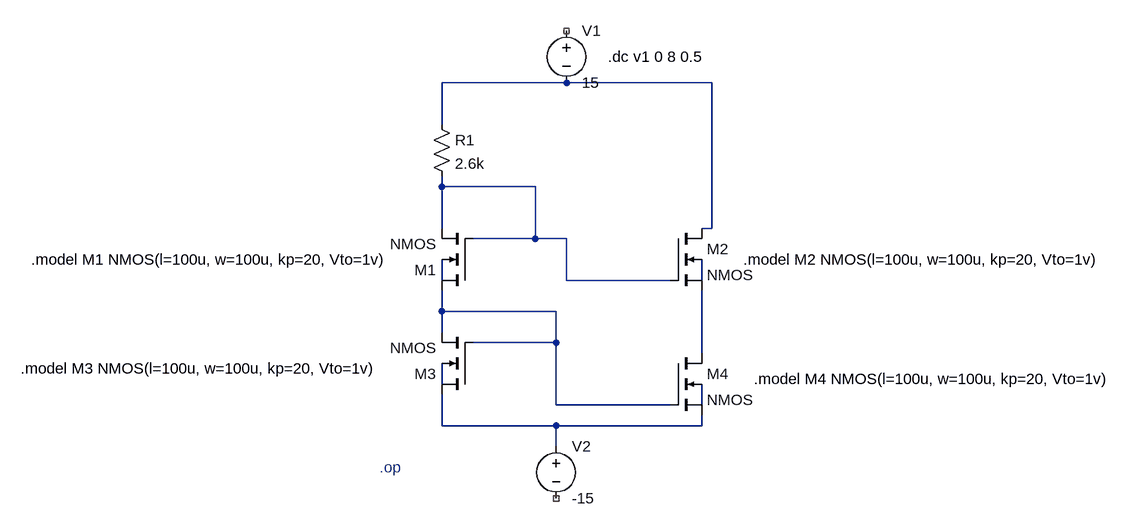
[diagram p0: schematic Simulation4.asc]
Simulation4.asc, the LTspice schematic file:
Version 4.1
SHEET 1 1104 736
WIRE 208 80 16 80
WIRE 432 80 208 80
WIRE 16 144 16 80
WIRE 16 240 16 224
WIRE 160 240 16 240
WIRE 16 304 16 240
WIRE 432 304 432 80
WIRE 432 304 416 304
WIRE 160 320 160 240
WIRE 160 320 64 320
WIRE 208 320 160 320
WIRE 16 384 16 352
WIRE 208 384 208 320
WIRE 368 384 208 384
WIRE 416 384 416 352
WIRE 16 432 16 400
WIRE 192 432 16 432
WIRE 16 464 16 432
WIRE 192 480 192 432
WIRE 192 480 64 480
WIRE 416 496 416 400
WIRE 16 544 16 512
WIRE 192 576 192 480
WIRE 368 576 192 576
WIRE 416 576 416 544
WIRE 16 608 16 560
WIRE 192 608 16 608
WIRE 416 608 416 592
WIRE 416 608 192 608
WIRE 192 640 192 608
SYMBOL voltage 208 -16 R0
WINDOW 123 0 0 Left 0
WINDOW 39 0 0 Left 0
SYMATTR InstName V1
SYMATTR Value 15
SYMBOL res 0 128 R0
SYMATTR InstName R1
SYMATTR Value 2.6k
SYMBOL nmos4 64 400 R180
SYMATTR InstName M1
SYMBOL nmos4 368 304 R0
SYMATTR InstName M2
SYMBOL nmos4 64 560 R180
SYMATTR InstName M3
SYMBOL nmos4 368 496 R0
SYMATTR InstName M4
SYMBOL voltage 192 624 R0
WINDOW 123 0 0 Left 0
WINDOW 39 0 0 Left 0
SYMATTR InstName V2
SYMATTR Value -15
TEXT -80 672 Left 2 ;.op
TEXT 272 40 Left 2 !.dc v1 0 8 0.5
TEXT -616 352 Left 2 !.model M1 NMOS(l=100u, w=100u, kp=20, Vto=1v)
TEXT 480 352 Left 2 !.model M2 NMOS(l=100u, w=100u, kp=20, Vto=1v)
TEXT -632 520 Left 2 !.model M3 NMOS(l=100u, w=100u, kp=20, Vto=1v)
TEXT 496 536 Left 2 !.model M4 NMOS(l=100u, w=100u, kp=20, Vto=1v)

The netlist it stands for:
* Simulation4.asc
V1 NC_01 N001 15
R1 N001 N002 2.6k
M1 N005 N002 N002 N003 NMOS
M2 N001 N002 N006 N004 NMOS
M3 N009 N005 N005 N007 NMOS
M4 N006 N005 N009 N008 NMOS
V2 N009 NC_02 -15
.model NMOS NMOS
.model PMOS PMOS
.lib standard.mos
* .op
.dc v1 0 8 0.5
.model M1 NMOS(l=100u, w=100u, kp=20, Vto=1v)
.model M2 NMOS(l=100u, w=100u, kp=20, Vto=1v)
.model M3 NMOS(l=100u, w=100u, kp=20, Vto=1v)
.model M4 NMOS(l=100u, w=100u, kp=20, Vto=1v)
.backanno
.end